# Altium schematic sheet ADL5801.SchDoc
size A2; SheetNumber: 1; SheetTotal: 1
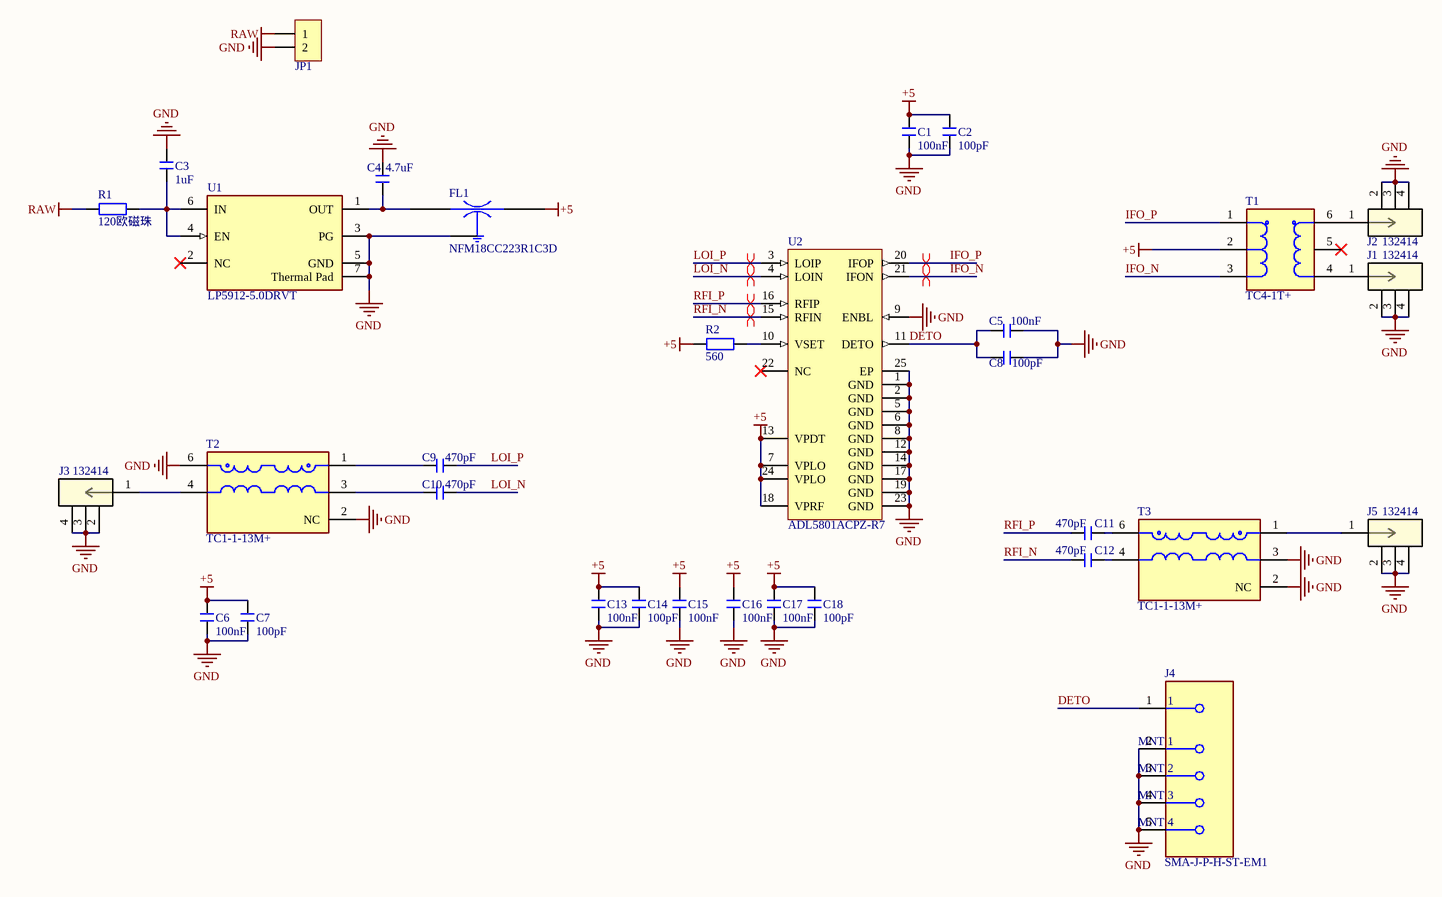
[diagram p0: ADL5801.SchDoc]

## Parts
C1  100nF  [C 0402_L]
C2  100pF  [C 0402_L]
C3  1uF  [C 0603_L]
C4  4.7uF  [C 0603_L]
C5  100nF  [C 0402_L]
C6  100nF  [C 0402_L]
C7  100pF  [C 0402_L]
C8  100pF  [C 0402_L]
C9  470pF  [C 0402_L]
C10  470pF  [C 0402_L]
C11  470pF  [C 0402_L]
C12  470pF  [C 0402_L]
C13  100nF  [C 0402_L]
C14  100pF  [C 0402_L]
C15  100nF  [C 0402_L]
C16  100nF  [C 0402_L]
C17  100nF  [C 0402_L]
C18  100pF  [C 0402_L]
FL1  NFM18CC223R1C3D  [FIL_NFM18CC223R1C3D]
J1  132414  [CONN_132414_AMP]
J2  132414  [CONN_132414_AMP]
J3  132414  [CONN_132414_AMP]
J4  SMA-J-P-H-ST-EM1  [FP-SMA-J-P-H-ST-EM1-MFG]
J5  132414  [CONN_132414_AMP]
JP1  HDR-1X2  [KF2510-LI-2P]  (value not drawn)
R1  120欧磁珠  [R 0603_L]
R2  560  [R 0402_L]
T1  TC4-1T+  [TC4-1T+-Footprint-1]
T2  TC1-1-13M+  [FP-TC1-1-13M+-MFG]
T3  TC1-1-13M+  [FP-TC1-1-13M+-MFG]
U1  LP5912-5.0DRVT  [FP-DRV0006A-IPC_C]
U2  ADL5801ACPZ-R7  [ADI-CP-24-3_M]

## Nets
+5: C1.2 C2.2 C6.2 C7.2 C13.2 C14.2 C15.2 C16.2 C17.2 C18.2 FL1.3 R2.1 T1.2(SECONDARY) U2.7(VPLO) U2.13(VPDT) U2.18(VPRF) U2.24(VPLO)
GND: C1.1 C2.1 C3.2 C4.2 C5.2 C6.1 C7.1 C8.2 C13.1 C14.1 C15.1 C16.1 C17.1 C18.1 FL1.2(GND) J1.2 J1.3 J1.4 J2.2 J2.3 J2.4 J3.2 J3.3 J3.4 J4.2(MNT_1) J4.3(MNT_2) J4.4(MNT_3) J4.5(MNT_4) J5.2 J5.3 J5.4 JP1.2 T2.2(NC) T2.6(PRIMARY_DOT) T3.2(NC) T3.3(SECONDARY) U1.3(PG) U1.5(GND) U1.7(Thermal_Pad) U2.1(GND) U2.2(GND) U2.5(GND) U2.6(GND) U2.8(GND) U2.9(ENBL) U2.12(GND) U2.14(GND) U2.17(GND) U2.19(GND) U2.23(GND) U2.25(EP)
RAW: JP1.1 R1.1
DETO: C5.1 C8.1 J4.1 U2.11(DETO)
IFO_N: T1.3(SECONDARY_MID) U2.21(IFON)
IFO_P: T1.1(SECONDARY_DOT) U2.20(IFOP)
LOI_N: C10.2 U2.4(LOIN)
LOI_P: C9.2 U2.3(LOIP)
RFI_N: C12.1 U2.15(RFIN)
RFI_P: C11.1 U2.16(RFIP)
NetC3_1: C3.1 R1.2 U1.4(EN) U1.6(IN)
NetC4_1: C4.1 FL1.1 U1.1(OUT)
NetC9_1: C9.1 T2.1(SECONDARY_DOT)
NetC10_1: C10.1 T2.3(SECONDARY)
NetC11_2: C11.2 T3.6(PRIMARY_DOT)
NetC12_2: C12.2 T3.4(PRIMARY)
NetJ1_1: J1.1 T1.4(PRIMARY)
NetJ2_1: J2.1 T1.6(PRIMARY_DOT)
NetJ3_1: J3.1 T2.4(PRIMARY)
NetJ5_1: J5.1 T3.1(SECONDARY_DOT)
NetR2_2: R2.2 U2.10(VSET)

Not connected (* = marked no-connect by the designer): T1 5(NC)*; U1 2(NC)*; U2 22(NC)*

## Layout directives
differential pair: IFO_N, IFO_P, LOI_N, LOI_P, RFI_N, RFI_P

## Library data of the parts
C1-C18 = C: 贴片电容; 淘宝ID: 小糖豆的小窝窝; BOM名称: 贴片电容; 下单链接: https://item.taobao.com/item.htm?ft=t&id=613637044352
FL1 = NFM18CC223R1C3D: SMD Capacitor with Capacitance: 22000pF Tol. 20%. Rated Voltage: 16Vdc; MF: Murata; MP: NFM18CC223R1C3D; SnapEDA_Link: https://www.snapeda.com/parts/NFM18CC223R1C3D/Murata/view-part/?ref=snap; Availability: In Stock; Package: NONSTANDARD; Check_prices: https://www.snapeda.com/parts/NFM18CC223R1C3D/Murata/view-part/?ref=eda; Value: *; Purchase-URL: https://pricing.snapeda.com/search/part/NFM18CC223R1C3D/?ref=eda; Price: None
J1-J3 J5 = 132414: No Description Available; Mfr_Name: Amphenol ICC; Copyright: Copyright (C) 2022 Ultra Librarian. All rights reserved.; Manufacturer_Part_Number: 132414; RefDes: RefDes; Type: DEV
J4 = CMP-02754-000006-1: CONN SMA JACK STR 50OHM EDGE MNT; Dielectric Material: PTFE; Center Contact Plating: Gold; Max Frequency: 6GHz; Body Material: Brass; Voltage Rating: 335V; Impedance: 50R; Package Quantity: 1; Case/Package: SMA; Max Operating Temperature: 125°C; Fastening Type: Threaded; Orientation: Straight; Depth: 13.33mm; RoHS Compliant: Yes; Length: 6.35mm; Insulation Material: Polytetrafluoroethylene; Termination: Solder; Min Operating Temperature: -65°C; Housing Color: Gold; Contact Plating: Gold; Contact Material: Copper; Connector Type: SMA; Mount: Edge; Series: SMA; Packaging: Tray; Body Plating: Gold; Radiation Hardening: No
JP1 = Header 2: 2P接插件; 淘宝ID: 小糖豆的小窝窝; BOM名称: 2P接插件; 下单链接: https://item.taobao.com/item.htm?ft=t&id=613637044352
R1 R2 = R: 贴片电阻; 淘宝ID: 小糖豆的小窝窝; BOM名称: 贴片电阻; 下单链接: https://item.taobao.com/item.htm?ft=t&id=613637044352
T1 = TC4-1T+: Xfmr, Isolation, 50 ohm, 4: 1, 0.5-300 MHz, SMT
T2 T3 = CMP-00025-00004-2: RF Transformer 1: 1 5 Terminal SMD; RoHS Compliant: Yes
U1 = CMP-019-00049-1: Linear Voltage Regulator IC Positive Fixed 1 Output 5.0V 500mA 6-SON (2x2); Output Voltage: 5V; Dropout Voltage: 950mV; Max Operating Temperature: 125°C; Output Current: 500mA; Case/Package: SON; RoHS Compliant: Yes; Pins: 6; Mounting Technology: Surface Mount; Min Operating Temperature: -40°C
U2 = CMP-00025-00005-1: RF Mixer IC Cellular Up/Down Converter 10MHz ~ 6GHz 24-LFCSP-VQ (4x4); Pins: 24; Frequency: 10MHz; Case/Package: LFCSP EP; RoHS Compliant: Yes; Min Operating Temperature: -40°C; Max Operating Temperature: 85°C